# EAGLE schematic Motor-Board (EAGLE 7.3.0)

## Sheet 1 of 5
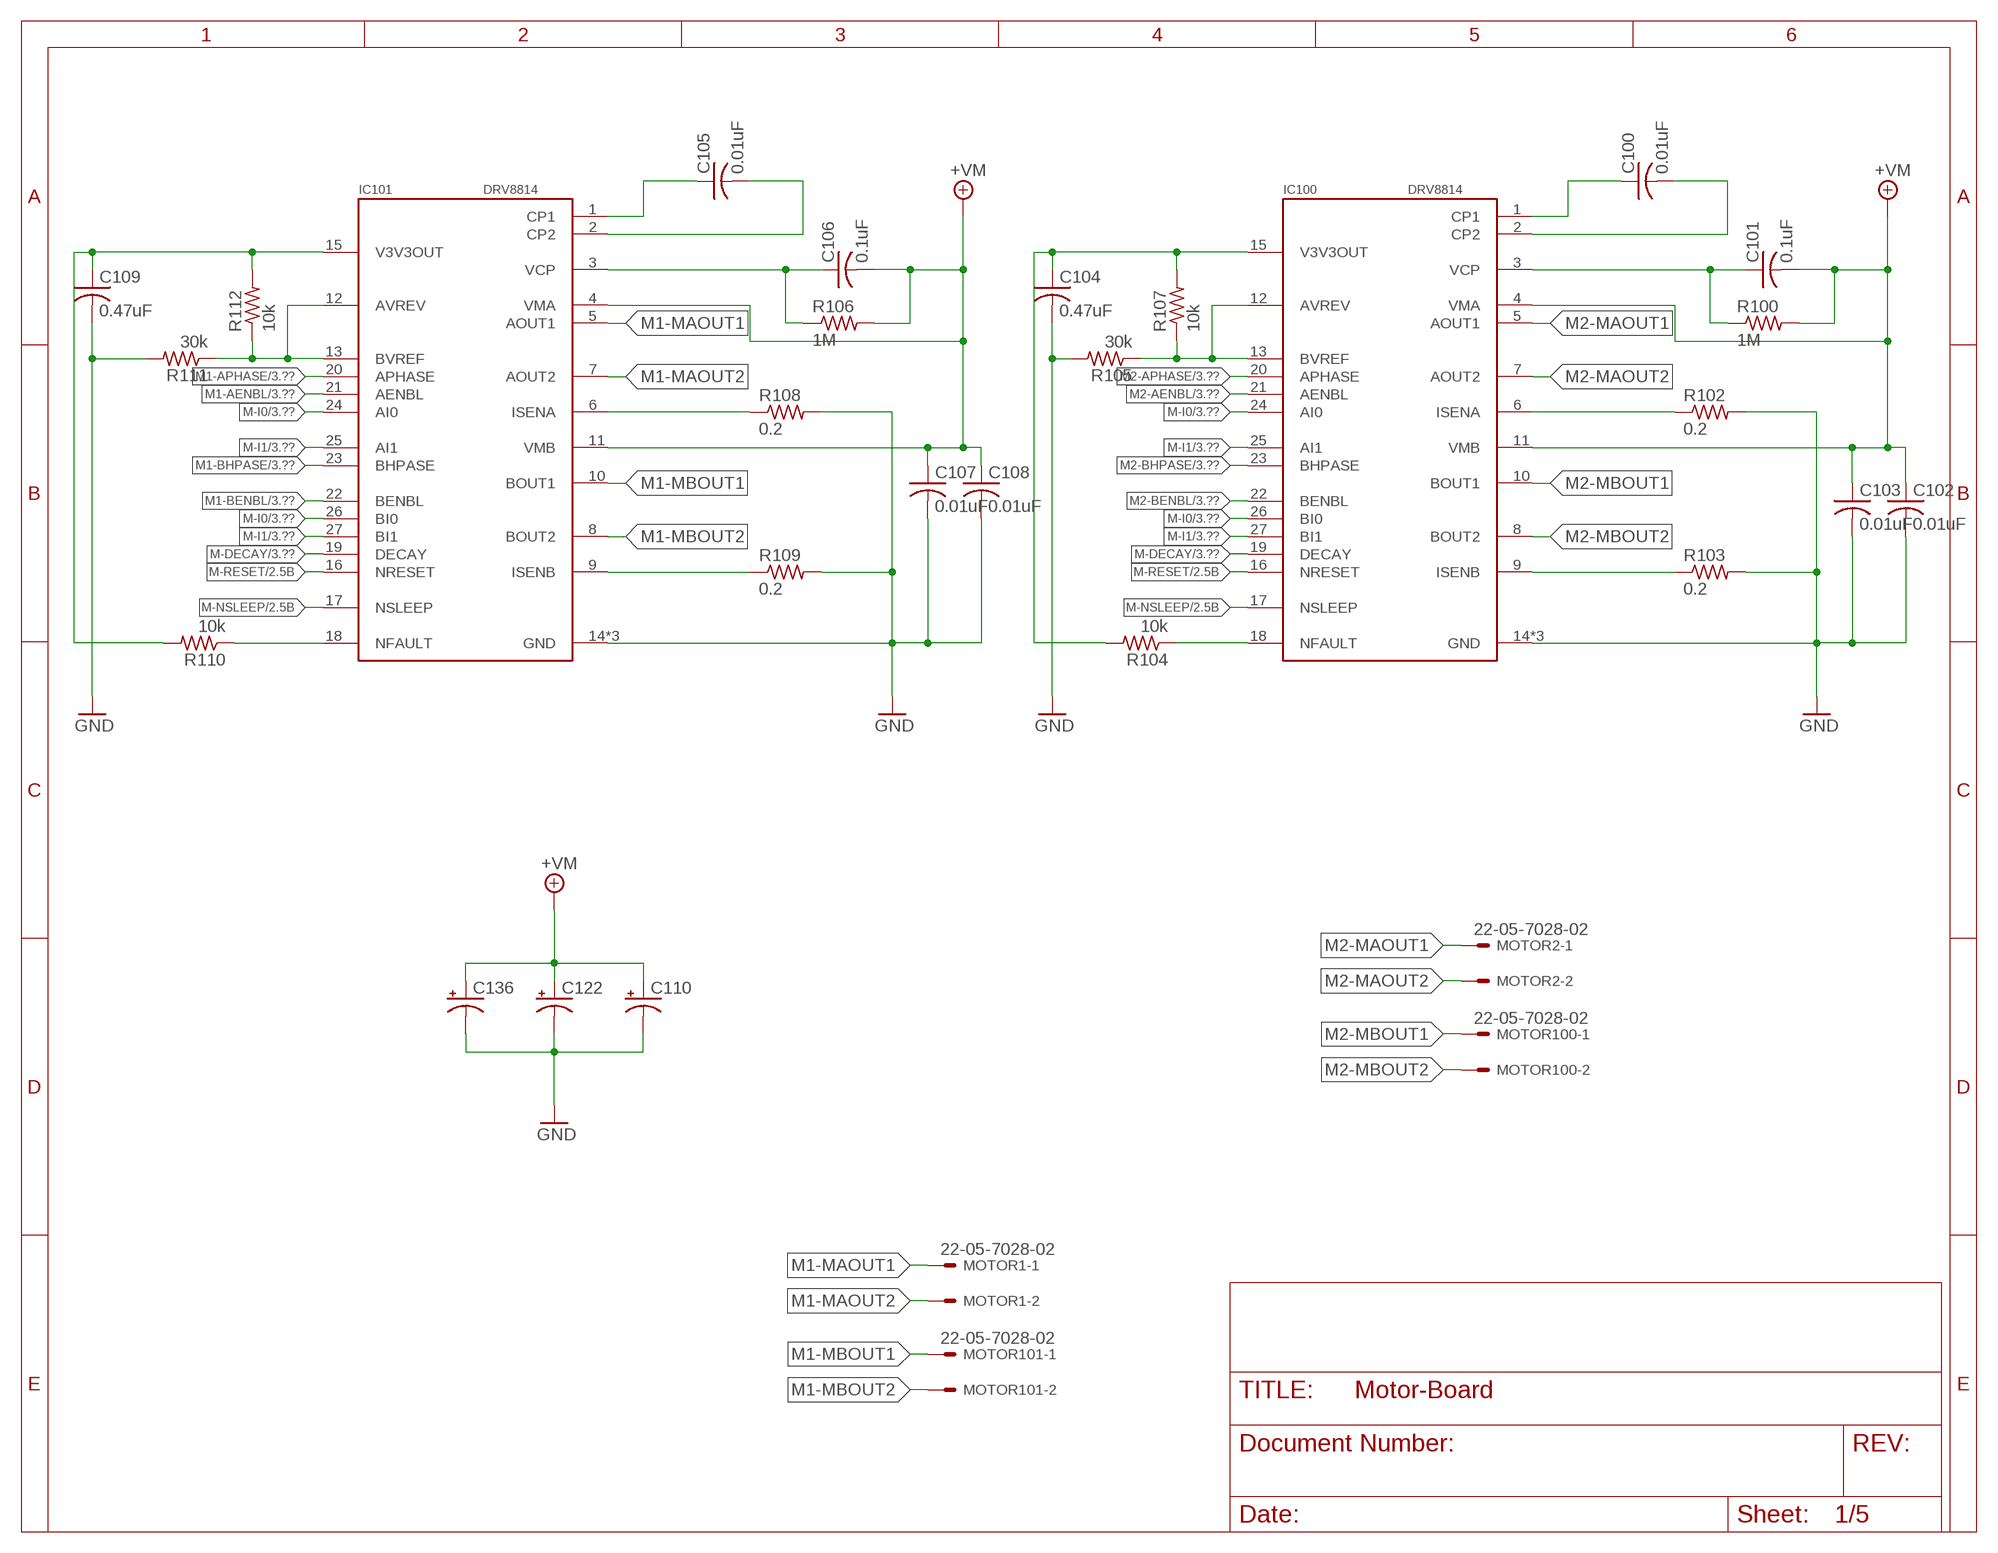
[diagram p0: schematic, sheet 1]

### Parts
C100  0.01uF  C-USC0402  [C0402]
C101  0.1uF  C-USC0402  [C0402]
C102  0.01uF  C-USC0402  [C0402]
C103  0.01uF  C-USC0402  [C0402]
C104  0.47uF  C-USC0402  [C0402]
C105  0.01uF  C-USC0402  [C0402]
C106  0.1uF  C-USC0402  [C0402]
C107  0.01uF  C-USC0402  [C0402]
C108  0.01uF  C-USC0402  [C0402]
C109  0.47uF  C-USC0402  [C0402]
C110  CPOL-US153CLV-0605  [153CLV-0605]
C122  CPOL-US153CLV-0605  [153CLV-0605]
C136  CPOL-US153CLV-0605  [153CLV-0605]
IC100  DRV8814  DRV8818PWPR  [TSSOP-28]
IC101  DRV8814  DRV8818PWPR  [TSSOP-28]
MOTOR1  22-05-7028-02  [7395-02]
MOTOR2  22-05-7028-02  [7395-02]
MOTOR100  22-05-7028-02  [7395-02]
MOTOR101  22-05-7028-02  [7395-02]
R100  1M  R-US_R0402  [R0402]
R102  0.2  R-US_R0402  [R0402]
R103  0.2  R-US_R0402  [R0402]
R104  10k  R-US_R0402  [R0402]
R105  30k  R-US_R0402  [R0402]
R106  1M  R-US_R0402  [R0402]
R107  10k  R-US_R0402  [R0402]
R108  0.2  R-US_R0402  [R0402]
R109  0.2  R-US_R0402  [R0402]
R110  10k  R-US_R0402  [R0402]
R111  30k  R-US_R0402  [R0402]
R112  10k  R-US_R0402  [R0402]

### Nets
+7V [VM]: C101.2 C102.1 C103.1 C106.2 C107.1 C108.1 C110.+ C122.+ C136.+ IC100.4(VMA) IC100.11(VMB) IC101.4(VMA) IC101.11(VMB) R100.2 R106.2 ; supply symbol labelled +VM ; also sheet 2,3,4
GND: C102.2 C103.2 C104.2 C107.2 C108.2 C109.2 C110.- C122.- C136.- IC100.14(GND) IC100.28(GND) IC100.EXP(GND) IC101.14(GND) IC101.28(GND) IC101.EXP(GND) R102.2 R103.2 R105.2 R108.2 R109.2 R111.2 ; also sheet 2,3,4
M1-AENBL: IC101.21(AENBL) ; also sheet 3
M1-APHASE: IC101.20(APHASE) ; also sheet 3
M1-BENBL: IC101.22(BENBL) ; also sheet 3
M1-BHPASE: IC101.23(BHPASE) ; also sheet 3
M1-MAOUT1: IC101.5(AOUT1) MOTOR1.1
M1-MAOUT2: IC101.7(AOUT2) MOTOR1.2
M1-MBOUT1: IC101.10(BOUT1) MOTOR101.1
M1-MBOUT2: IC101.8(BOUT2) MOTOR101.2
M2-AENBL: IC100.21(AENBL) ; also sheet 3
M2-APHASE: IC100.20(APHASE) ; also sheet 3
M2-BENBL: IC100.22(BENBL) ; also sheet 3
M2-BHPASE: IC100.23(BHPASE) ; also sheet 3
M2-MAOUT1: IC100.5(AOUT1) MOTOR2.1
M2-MAOUT2: IC100.7(AOUT2) MOTOR2.2
M2-MBOUT1: IC100.10(BOUT1) MOTOR100.1
M2-MBOUT2: IC100.8(BOUT2) MOTOR100.2
M-DECAY: IC100.19(DECAY) IC101.19(DECAY) ; also sheet 3
M-I0: IC100.24(AI0) IC100.26(BI0) IC101.24(AI0) IC101.26(BI0) ; also sheet 3
M-I1: IC100.25(AI1) IC100.27(BI1) IC101.25(AI1) IC101.27(BI1) ; also sheet 3
M-NSLEEP: IC100.17(NSLEEP) IC101.17(NSLEEP) ; also sheet 2,3
M-RESET: IC100.16(NRESET) IC101.16(NRESET) ; also sheet 2,3
N$1: C105.2 IC101.2(CP2)
N$2: C105.1 IC101.1(CP1)
N$3: C106.1 IC101.3(VCP) R106.1
N$4: IC101.6(ISENA) R108.1
N$5: C100.2 IC100.2(CP2)
N$6: C100.1 IC100.1(CP1)
N$7: C101.1 IC100.3(VCP) R100.1
N$8: IC100.6(ISENA) R102.1
N$9: IC100.9(ISENB) R103.1
N$10: IC101.9(ISENB) R109.1
N$11: IC100.12(AVREV) IC100.13(BVREF) R105.1 R107.1
N$12: IC101.12(AVREV) IC101.13(BVREF) R111.1 R112.1
N$29 [+3v3]: C109.1 IC101.15(V3V3OUT) R110.2 R112.2
N$31: IC101.18(NFAULT) R110.1
N$35: IC100.18(NFAULT) R104.1
N$37 [+3v3]: C104.1 IC100.15(V3V3OUT) R104.2 R107.2

## Sheet 2 of 5
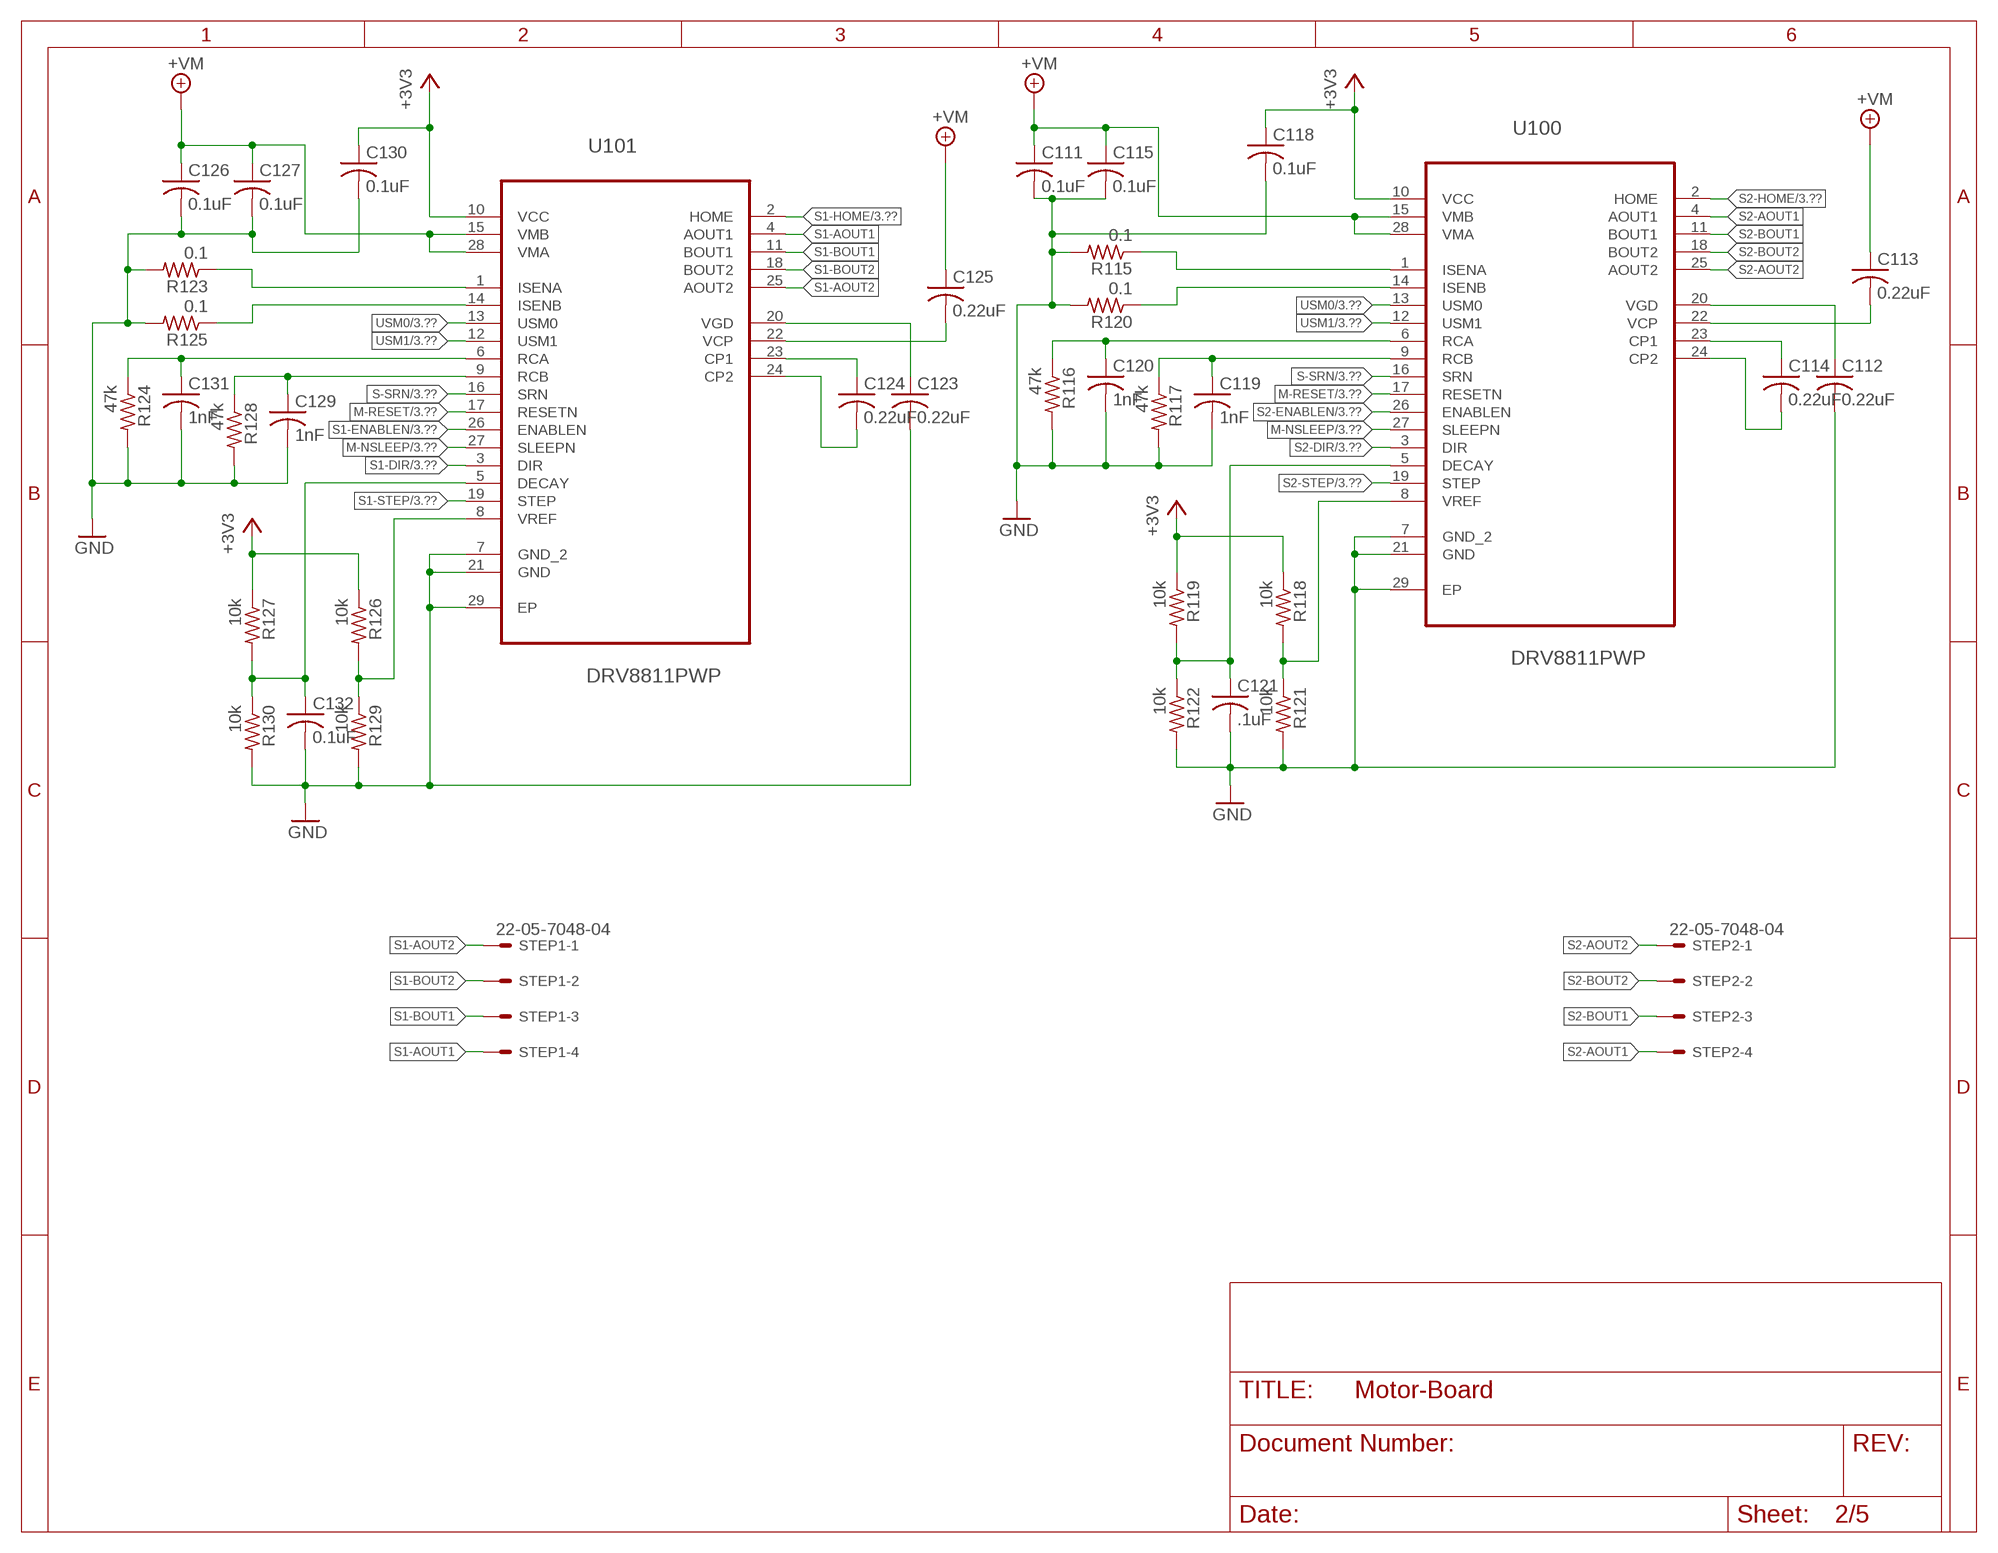
[diagram p1: schematic, sheet 2]

### Parts
C111  0.1uF  C-USC0402  [C0402]
C112  0.22uF  C-USC0402  [C0402]
C113  0.22uF  C-USC0402  [C0402]
C114  0.22uF  C-USC0402  [C0402]
C115  0.1uF  C-USC0402  [C0402]
C118  0.1uF  C-USC0402  [C0402]
C119  1nF  C-USC0402  [C0402]
C120  1nF  C-USC0402  [C0402]
C121  .1uF  C-USC0402  [C0402]
C123  0.22uF  C-USC0402  [C0402]
C124  0.22uF  C-USC0402  [C0402]
C125  0.22uF  C-USC0402  [C0402]
C126  0.1uF  C-USC0402  [C0402]
C127  0.1uF  C-USC0402  [C0402]
C129  1nF  C-USC0402  [C0402]
C130  0.1uF  C-USC0402  [C0402]
C131  1nF  C-USC0402  [C0402]
C132  0.1uF  C-USC0402  [C0402]
R115  0.1  R-US_R0402  [R0402]
R116  47k  R-US_R0402  [R0402]
R117  47k  R-US_R0402  [R0402]
R118  10k  R-US_R0402  [R0402]
R119  10k  R-US_R0402  [R0402]
R120  0.1  R-US_R0402  [R0402]
R121  10k  R-US_R0402  [R0402]
R122  10k  R-US_R0402  [R0402]
R123  0.1  R-US_R0402  [R0402]
R124  47k  R-US_R0402  [R0402]
R125  0.1  R-US_R0402  [R0402]
R126  10k  R-US_R0402  [R0402]
R127  10k  R-US_R0402  [R0402]
R128  47k  R-US_R0402  [R0402]
R129  10k  R-US_R0402  [R0402]
R130  10k  R-US_R0402  [R0402]
STEP1  22-05-7048-04  [7395-04]
STEP2  22-05-7048-04  [7395-04]
U100  DRV8811PWP  [SOP65P640X120-29N]
U101  DRV8811PWP  [SOP65P640X120-29N]

### Nets
+3V3 [+3v3]: C118.1 C130.1 R118.1 R119.1 R126.1 R127.1 U100.10(VCC) U101.10(VCC) ; also sheet 3
+7V [VM]: C111.1 C113.1 C115.1 C125.1 C126.1 C127.1 U100.15(VMB) U100.28(VMA) U101.15(VMB) U101.28(VMA) ; supply symbol labelled +VM ; also sheet 1,3,4
GND: C111.2 C112.2 C115.2 C118.2 C119.2 C120.2 C121.2 C123.2 C126.2 C127.2 C129.2 C130.2 C131.2 C132.2 R115.2 R116.2 R117.2 R120.2 R121.2 R122.2 R123.2 R124.2 R125.2 R128.2 R129.2 R130.2 U100.7(GND_2) U100.21(GND) U100.29(EP) U101.7(GND_2) U101.21(GND) U101.29(EP) ; also sheet 1,3,4
M-NSLEEP: U100.27(SLEEPN) U101.27(SLEEPN) ; also sheet 1,3
M-RESET: U100.17(RESETN) U101.17(RESETN) ; also sheet 1,3
N$13: R125.1 U101.14(ISENB)
N$14: R123.1 U101.1(ISENA)
N$15: R120.1 U100.14(ISENB)
N$16: R115.1 U100.1(ISENA)
N$17: C120.1 R116.1 U100.6(RCA)
N$18: C131.1 R124.1 U101.6(RCA)
N$19: C129.1 R128.1 U101.9(RCB)
N$20: C119.1 R117.1 U100.9(RCB)
N$21: C121.1 R119.2 R122.1 U100.5(DECAY)
N$22: R118.2 R121.1 U100.8(VREF)
N$23: C114.1 U100.23(CP1)
N$24: C114.2 U100.24(CP2)
N$26: C132.1 R127.2 R130.1 U101.5(DECAY)
N$27: C112.1 U100.20(VGD)
N$28: C113.2 U100.22(VCP)
N$30: R126.2 R129.1 U101.8(VREF)
N$32: C124.1 U101.23(CP1)
N$33: C124.2 U101.24(CP2)
N$34: C123.1 U101.20(VGD)
N$36: C125.2 U101.22(VCP)
S1-AOUT1: STEP1.4 U101.4(AOUT1)
S1-AOUT2: STEP1.1 U101.25(AOUT2)
S1-BOUT1: STEP1.3 U101.11(BOUT1)
S1-BOUT2: STEP1.2 U101.18(BOUT2)
S1-DIR: U101.3(DIR) ; also sheet 3
S1-ENABLEN: U101.26(ENABLEN) ; also sheet 3
S1-HOME: U101.2(HOME) ; also sheet 3
S1-STEP: U101.19(STEP) ; also sheet 3
S2-AOUT1: STEP2.4 U100.4(AOUT1)
S2-AOUT2: STEP2.1 U100.25(AOUT2)
S2-BOUT1: STEP2.3 U100.11(BOUT1)
S2-BOUT2: STEP2.2 U100.18(BOUT2)
S2-DIR: U100.3(DIR) ; also sheet 3
S2-ENABLEN: U100.26(ENABLEN) ; also sheet 3
S2-HOME: U100.2(HOME) ; also sheet 3
S2-STEP: U100.19(STEP) ; also sheet 3
S-SRN: U100.16(SRN) U101.16(SRN) ; also sheet 3
USM0: U100.13(USM0) U101.13(USM0) ; also sheet 3
USM1: U100.12(USM1) U101.12(USM1) ; also sheet 3

## Sheet 3 of 5
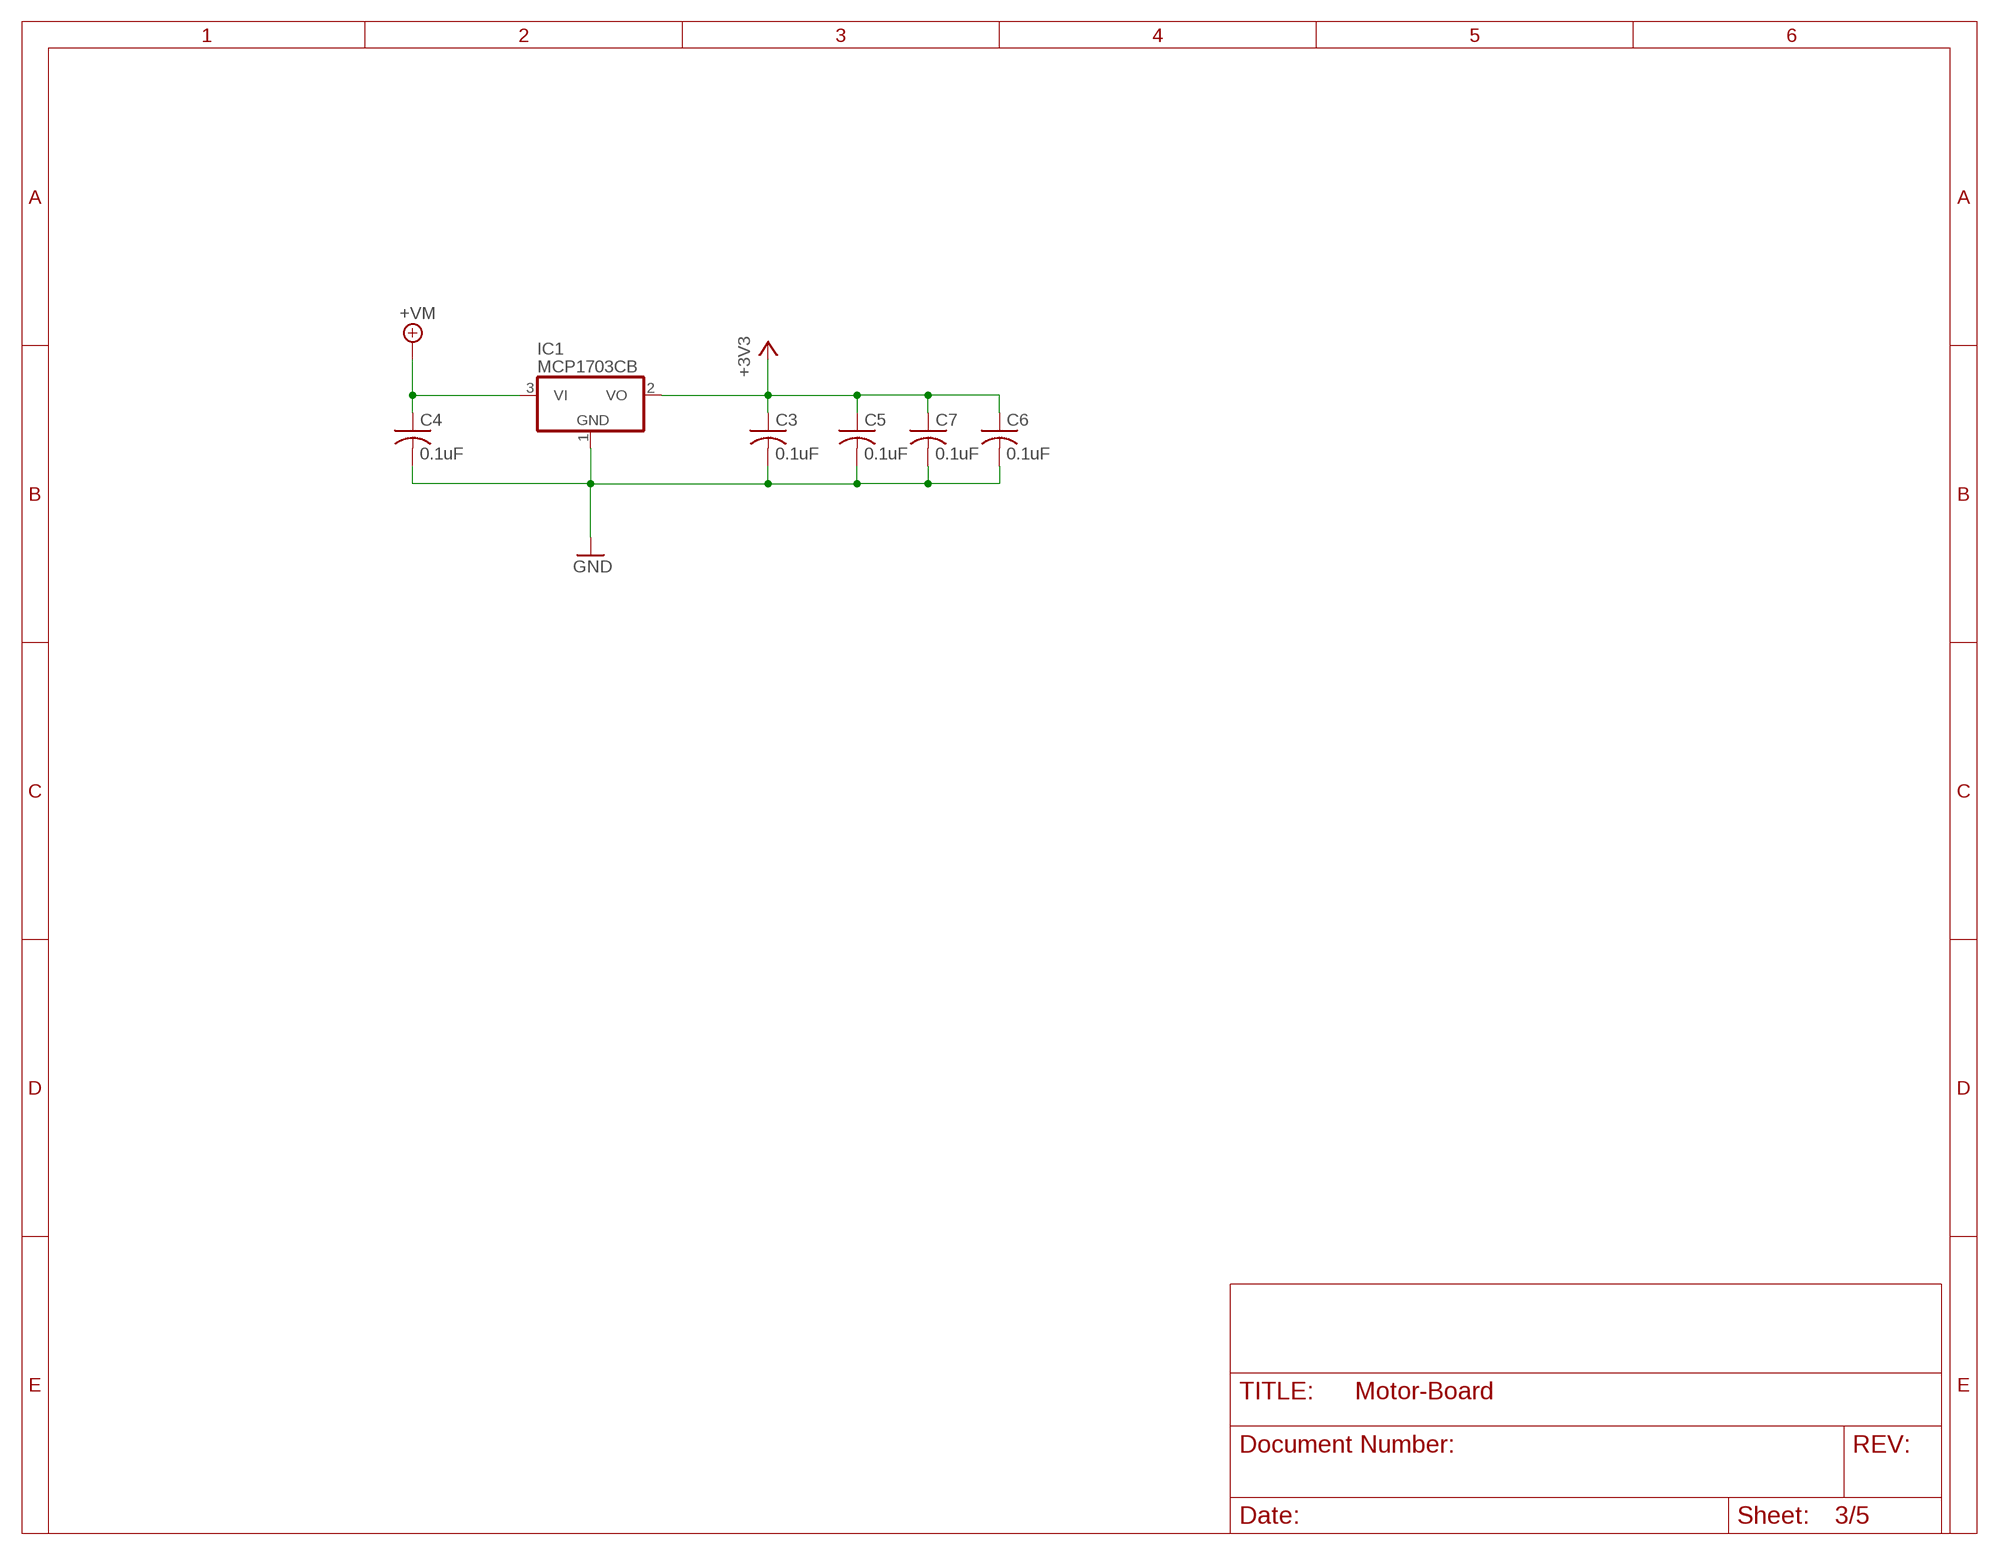
[diagram p2: schematic, sheet 3, part 1 of 2]
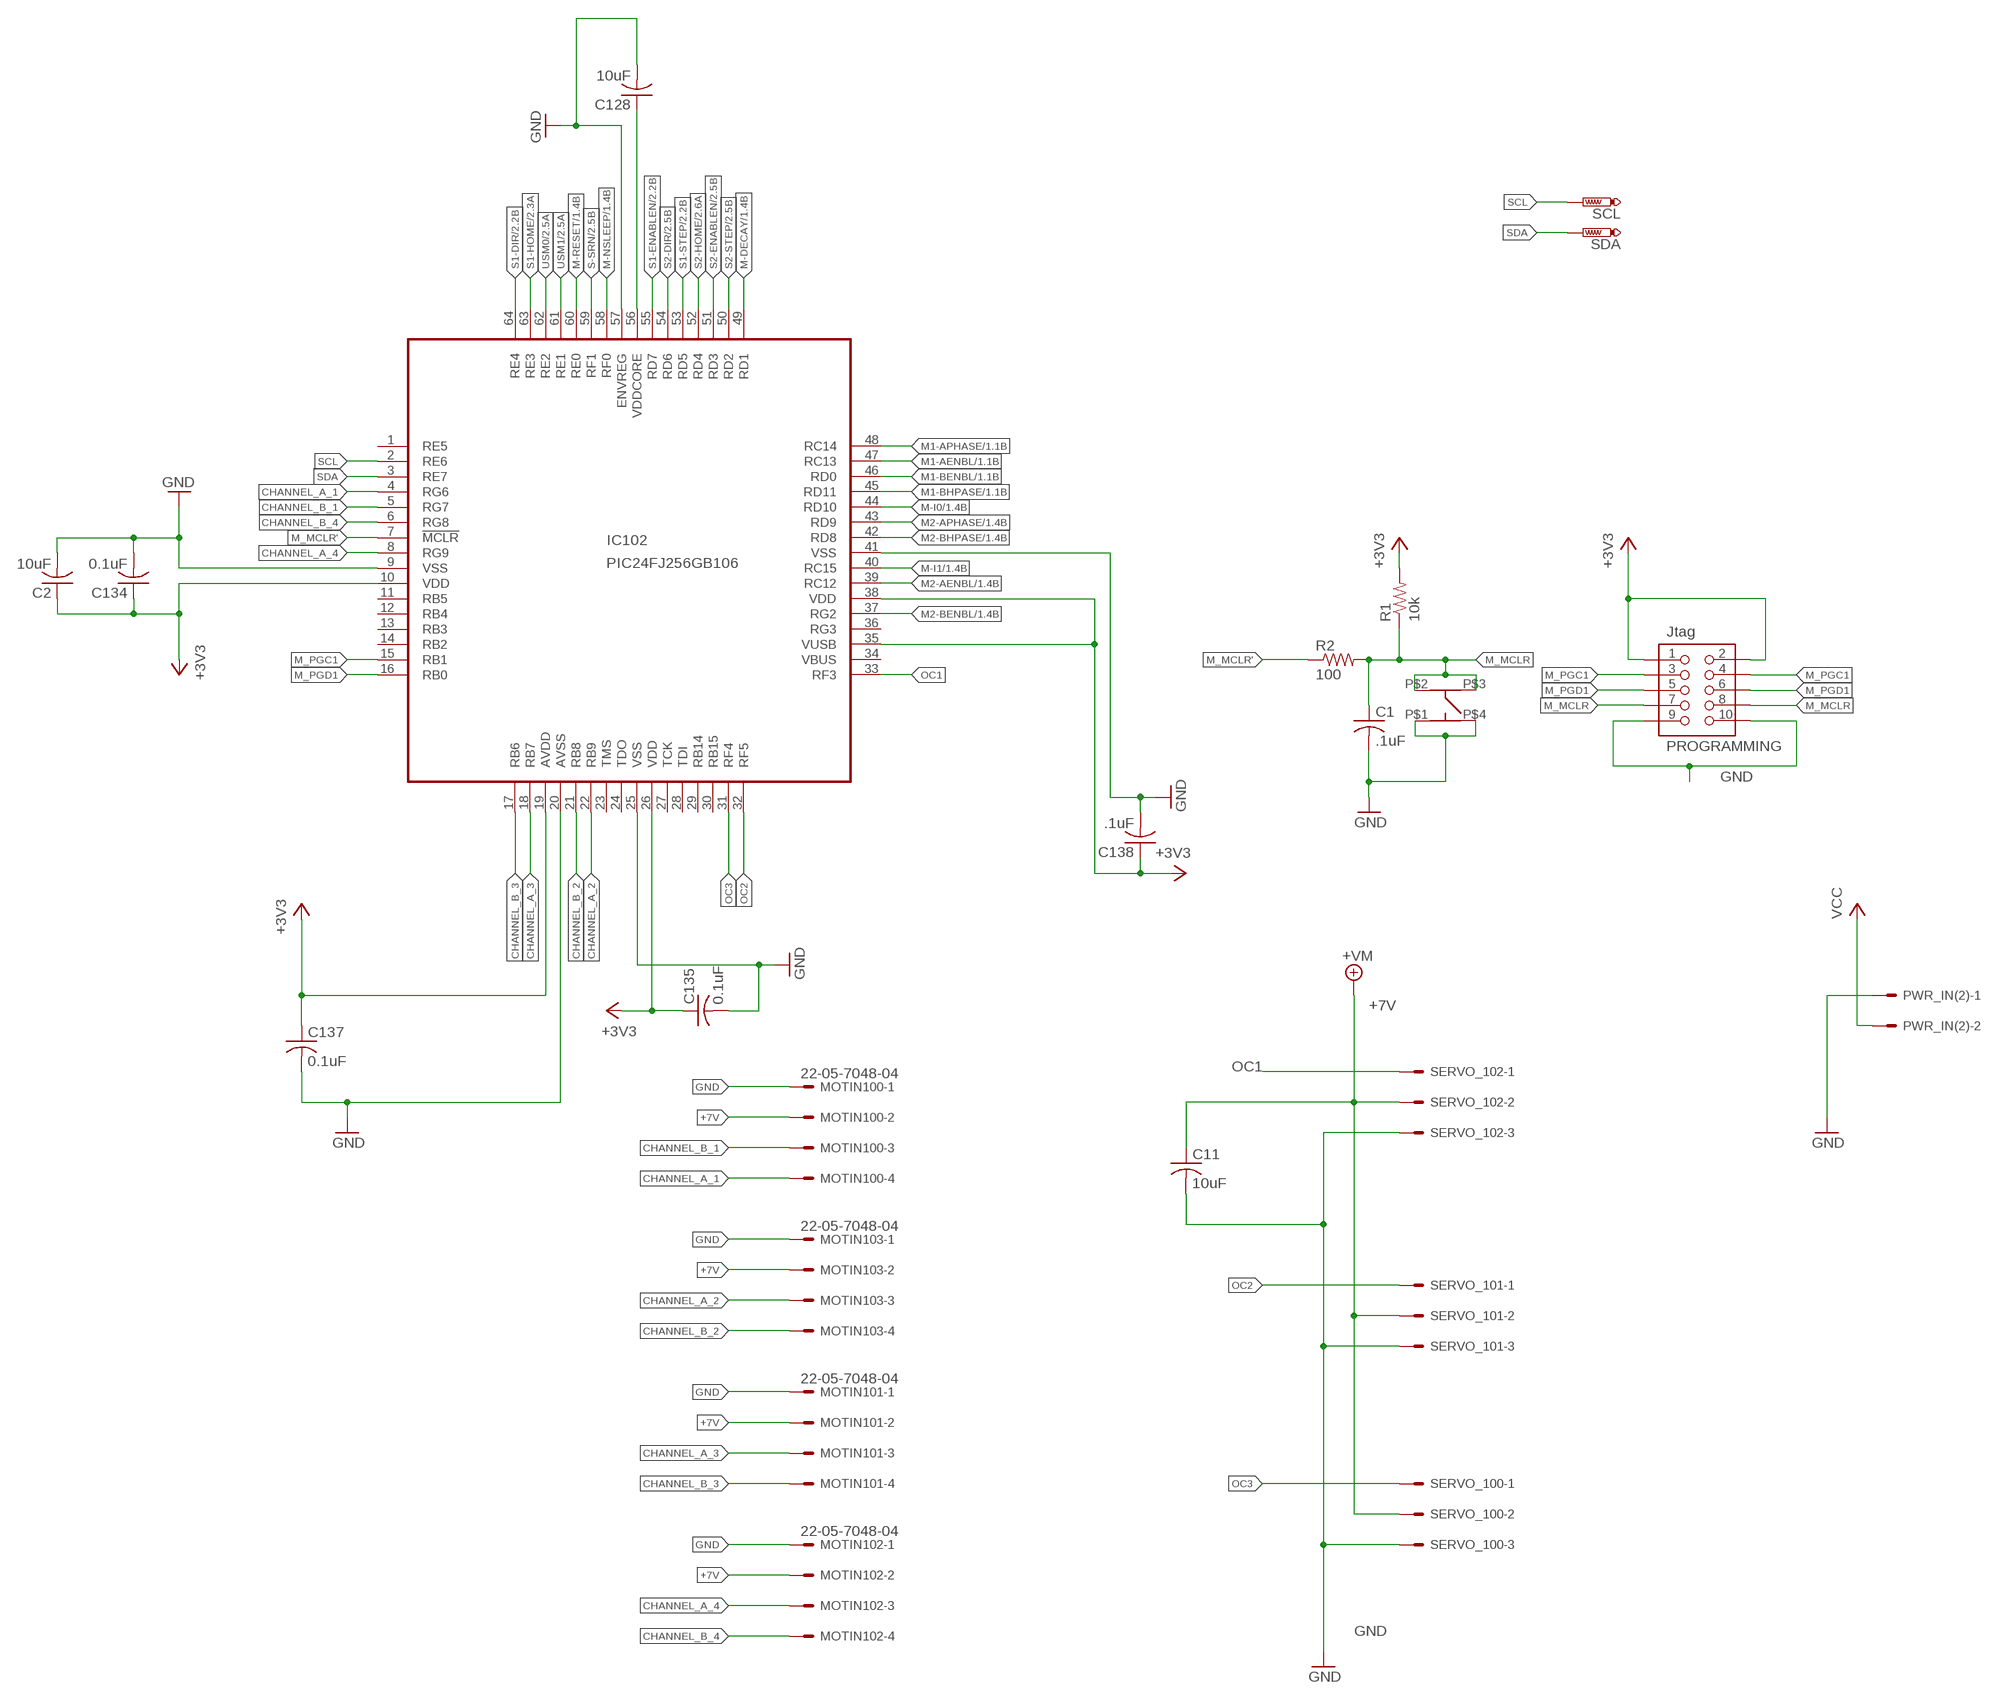
[diagram p3: schematic, sheet 3, part 2 of 2]

### Parts
C1  .1uF  C-USC0402  [C0402]
C2  10uF  C-USC0402  [C0402]
C3  0.1uF  C-USC0402  [C0402]
C4  0.1uF  C-USC0402  [C0402]
C5  0.1uF  C-USC0402  [C0402]
C6  0.1uF  C-USC0402  [C0402]
C7  0.1uF  C-USC0402  [C0402]
C11  10uF  C-USC0805  [C0805]
C128  10uF  C-USC0402  [C0402]
C134  0.1uF  C-USC0402  [C0402]
C135  0.1uF  C-USC0402  [C0402]
C137  0.1uF  C-USC0402  [C0402]
C138  .1uF  C-USC0402  [C0402]
IC1  MCP1703CB  [SOT23]
IC102  PIC24FJ256GB106  [TQFP64-10X10]
MOTIN100  22-05-7048-04  [7395-04]
MOTIN101  22-05-7048-04  [7395-04]
MOTIN102  22-05-7048-04  [7395-04]
MOTIN103  22-05-7048-04  [7395-04]
PROGRAMMING  Jtag  MOTHER-BOARD-REV5_PIN-CONNECTOR74089  [MOTHER-BOARD-REV5_10-PIN-SMD]
PWR_IN(2)  555X-2H  [5569-2]
R1  10k  R-US_R0402  [R0402]
R2  100  R-US_R0402  [R0402]
SCL  PTR1B1,27  [B1,27]
SDA  PTR1B1,27  [B1,27]
SERVO_100  22-05-7038-03  [7395-03]
SERVO_101  22-05-7038-03  [7395-03]
SERVO_102  22-05-7038-03  [7395-03]
U$100  Switch3  MC32882_SW  [MC32882_FINAL]

### Nets
+3V3 [+3v3]: C2.1 C3.1 C5.1 C6.1 C7.1 C134.1 C135.1 C137.1 C138.1 IC1.2(VO) IC102.10(VDD) IC102.19(AVDD) IC102.26(VDD) IC102.35(VUSB) IC102.38(VDD) PROGRAMMING.1 PROGRAMMING.2 R1.2 ; also sheet 2
+7V [VM]: C4.1 C11.1 IC1.3(VI) MOTIN100.2 MOTIN101.2 MOTIN102.2 MOTIN103.2 SERVO_100.2 SERVO_101.2 SERVO_102.2 ; supply symbol labelled +VM ; also sheet 1,2,4
CHANNEL_A_1: IC102.4(RG6) MOTIN100.4
CHANNEL_A_2: IC102.22(RB9) MOTIN103.3
CHANNEL_A_3: IC102.18(RB7) MOTIN101.3
CHANNEL_A_4: IC102.8(RG9) MOTIN102.3
CHANNEL_B_1: IC102.5(RG7) MOTIN100.3
CHANNEL_B_2: IC102.21(RB8) MOTIN103.4
CHANNEL_B_3: IC102.17(RB6) MOTIN101.4
CHANNEL_B_4: IC102.6(RG8) MOTIN102.4
GND: C1.2 C2.2 C3.2 C4.2 C5.2 C6.2 C7.2 C11.2 C128.2 C134.2 C135.2 C137.2 C138.2 IC1.1(GND) IC102.9(VSS) IC102.20(AVSS) IC102.25(VSS) IC102.41(VSS) IC102.57(ENVREG) MOTIN100.1 MOTIN101.1 MOTIN102.1 MOTIN103.1 PROGRAMMING.9 PROGRAMMING.10 PWR_IN(2).1 SERVO_100.3 SERVO_101.3 SERVO_102.3 U$100.P$1(P1) U$100.P$4(P4) ; also sheet 1,2,4
M1-AENBL: IC102.47(RC13) ; also sheet 1
M1-APHASE: IC102.48(RC14) ; also sheet 1
M1-BENBL: IC102.46(RD0) ; also sheet 1
M1-BHPASE: IC102.45(RD11) ; also sheet 1
M2-AENBL: IC102.39(RC12) ; also sheet 1
M2-APHASE: IC102.43(RD9) ; also sheet 1
M2-BENBL: IC102.37(RG2) ; also sheet 1
M2-BHPASE: IC102.42(RD8) ; also sheet 1
M-DECAY: IC102.49(RD1) ; also sheet 1
M-I0: IC102.44(RD10) ; also sheet 1
M-I1: IC102.40(RC15) ; also sheet 1
M-NSLEEP: IC102.58(RF0) ; also sheet 1,2
M-RESET: IC102.60(RE0) ; also sheet 1,2
M_MCLR: C1.1 PROGRAMMING.7 PROGRAMMING.8 R1.1 R2.2 U$100.P$2(P2) U$100.P$3(P3)
M_MCLR': IC102.7(!MCLR) R2.1
M_PGC1: IC102.15(RB1) PROGRAMMING.3 PROGRAMMING.4
M_PGD1: IC102.16(RB0) PROGRAMMING.5 PROGRAMMING.6
N$39: C128.1 IC102.56(VDDCORE)
OC1: IC102.33(RF3) SERVO_102.1
OC2: IC102.32(RF5) SERVO_101.1
OC3: IC102.31(RF4) SERVO_100.1
S1-DIR: IC102.64(RE4) ; also sheet 2
S1-ENABLEN: IC102.55(RD7) ; also sheet 2
S1-HOME: IC102.63(RE3) ; also sheet 2
S1-STEP: IC102.53(RD5) ; also sheet 2
S2-DIR: IC102.54(RD6) ; also sheet 2
S2-ENABLEN: IC102.51(RD3) ; also sheet 2
S2-HOME: IC102.52(RD4) ; also sheet 2
S2-STEP: IC102.50(RD2) ; also sheet 2
S-SRN: IC102.59(RF1) ; also sheet 2
SCL: IC102.2(RE6) SCL.TP
SDA: IC102.3(RE7) SDA.TP
USM0: IC102.62(RE2) ; also sheet 2
USM1: IC102.61(RE1) ; also sheet 2
VCC: PWR_IN(2).2 ; also sheet 4
Unconnected: IC102.1(RE5) IC102.11(RB5) IC102.12(RB4) IC102.13(RB3) IC102.14(RB2) IC102.23(TMS) IC102.24(TDO) IC102.27(TCK) IC102.28(TDI) IC102.29(RB14) IC102.30(RB15) IC102.34(VBUS) IC102.36(RG3)

## Sheet 4 of 5
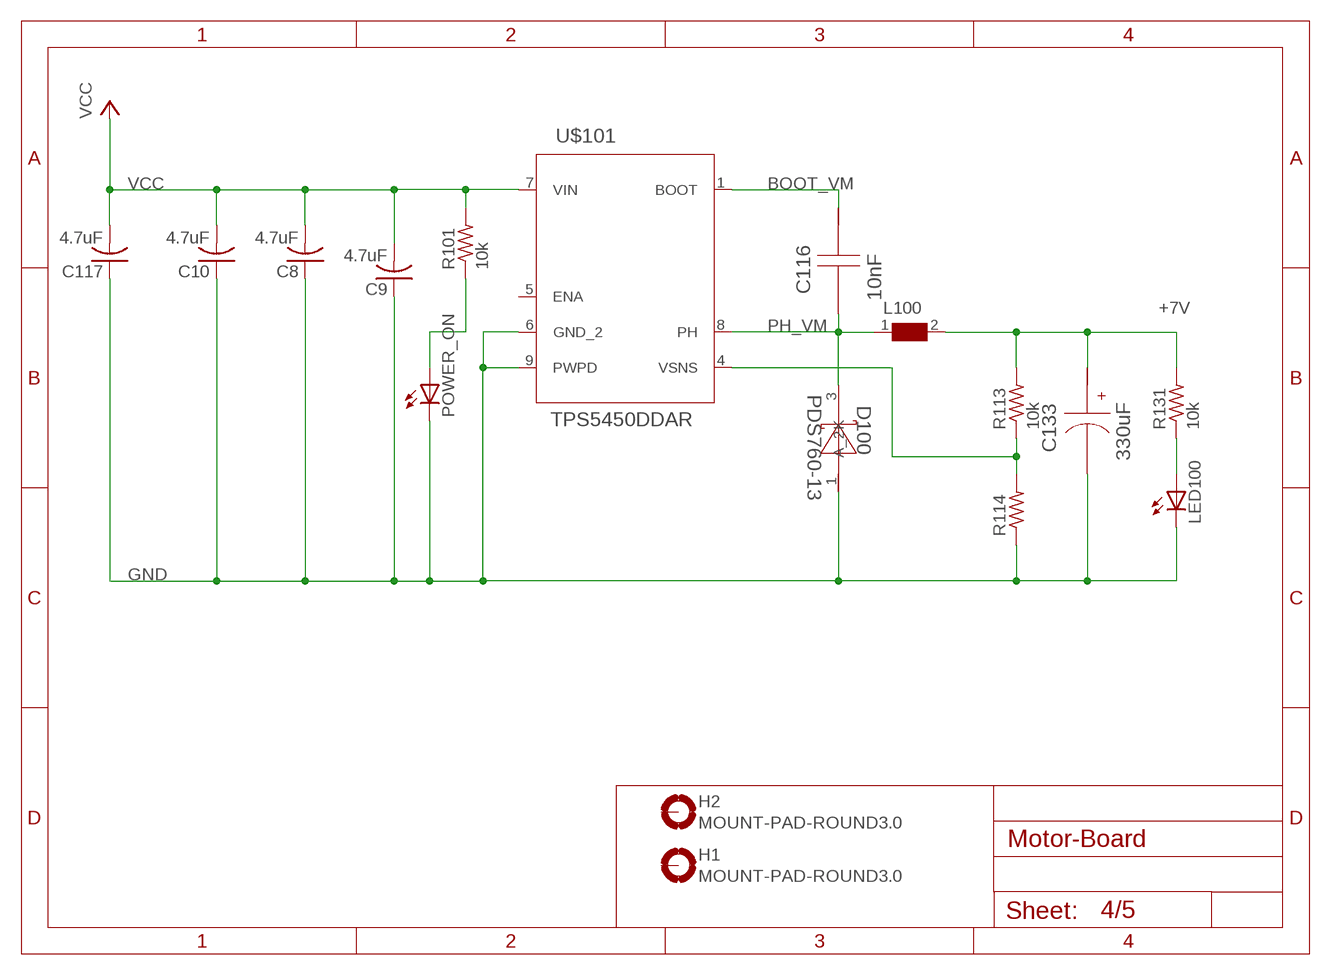
[diagram p4: schematic, sheet 4]

### Parts
C8  4.7uF  C-USC0805  [C0805]
C9  4.7uF  C-USC0805  [C0805]
C10  4.7uF  C-USC0805  [C0805]
C116  10nF  C0805C103K5RACTU  [0805]
C117  4.7uF  C-USC0805  [C0805]
C133  330uF  10SVP330MX  [SM_RADIAL_10AMM]
D100  PDS760-13  [POWERDI5]
H1  MOUNT-PAD-ROUND3.0  [3,0-PAD]
H2  MOUNT-PAD-ROUND3.0  [3,0-PAD]
L100  WE-HCC-7443331000_1090  [WE-HCC_1090]
LED100  LEDCHIP-LED0603  [CHIP-LED0603]
POWER_ON  LEDCHIP-LED0603  [CHIP-LED0603]
R101  10k  R-US_R0402  [R0402]
R113  10k  R-US_R0402  [R0402]
R114  R-US_R0402  [R0402]
R131  10k  R-US_R0402  [R0402]
U$101  TPS5450DDAR  [R-PDSO-G8]

### Nets
+7V [VM]: C133.1(+) L100.2 R113.2 R131.2 ; also sheet 1,2,3
BOOT_VM: C116.1 U$101.1(BOOT)
GND: C8.1 C9.1 C10.1 C117.1 C133.2(-) D100.1(A_2) LED100.C POWER_ON.C R114.1 U$101.6(GND_2) U$101.9(PWPD) ; also sheet 1,2,3
N$25: LED100.A R131.1
N$38: POWER_ON.A R101.1
PH_VM: C116.2 D100.3(K) L100.1 U$101.8(PH)
VCC: C8.2 C9.2 C10.2 C117.2 R101.2 U$101.7(VIN) ; also sheet 3
VSNS_VM: R113.1 R114.2 U$101.4(VSNS)
Unconnected: H1.B3,0(MOUNT) H2.B3,0(MOUNT) U$101.5(ENA)

## Sheet 5 of 5

## Library data of the parts
C1-C11 C100-C109 C111-C115 C117-C121 C123-C132 C134 C135 C137 C138 = rcl:C-US: CAPACITOR, American symbol
C110 C122 C136 = rcl:CPOL-US: POLARIZED CAPACITOR, American symbol
C116 = 5v:C0805C103K5RACTU; CAP: 1.0E-8; ESR: 1.739; IRMS: 0.411; MANUFACTURER_NAME: Kemet; MANUFACTURER_PART_NUMBER: C0805C103K5RACTU; VDC: 50.0; VENDOR: Kemet
C133 = 5v:10SVP330MX; CAP: 3.3E-4; DATASHEETURL: http://www.edc.sanyo.com/english/pdf/oscon/E32.pdf; ESR: 0.025; IRMS: 3.7; MANUFACTURER_NAME: Panasonic; MANUFACTURER_PART_NUMBER: 10SVP330MX; VDC: 10.0; VENDOR: Panasonic
D100 = 5v:PDS760-13; DATASHEETURL: www.diodes.com/datasheets/ds30477.pdf; IO: 7.0; MANUFACTURER_NAME: Diodes Inc.; MANUFACTURER_PART_NUMBER: PDS760-13; VENDOR: Diodes Inc.; VFATIO: 0.56; VRRM: 60.0
H1 H2 = holes:MOUNT-PAD-ROUND: MOUNTING PAD, round
IC1 = linear:MCP1703: 250 mA, 16V, Low Quiescent Current LDO Regulator Source: http://ww1.microchip.com/downloads/en/DeviceDoc/22049b.pdf
IC100 IC101 = Motor-Board:DRV8818PWPR: Driver controlador de motor en paquete HTSSOP
IC102 = microchip:PIC24FJ256GB106: PIC24FJ256GB106 edit this description Auto generated by make-symbol-device-package-bsdl.ulp Rev. 25 Source: PIC24FJ256GB106.bsd; MPN: PIC24FJ256GB106-I/PT; OC_FARNELL: 1576868; OC_NEWARK: 54M5129
L100 = WE-HCC:WE-HCC: SMD High Current Cube Inductor WE-HCC - magnetically shieled - current capability up to 27A - excellent saturation characteristics -- filter choke for DC/DC converter -- single and polyphase buck converter -- filter choke for motor electronics; MPN: 7443331000; OC_FARNELL: 1848254; OC_NEWARK: 13T9771; PACKAGE: 1090; SUPPLIER: Wuerth Elektronik
LED100 POWER_ON = led:LED: LED OSRAM: - CHIPLED LG R971, LG N971, LY N971, LG Q971, LY Q971, LO R971, LY R971 LH N974, LH R974 LS Q976, LO Q976, LY Q976 LO Q996 - Hyper CHIPLED LW Q18S LB Q993, LB Q99A, LB R99A - SideLED LS A670, LO A670, LY A670, LG A670, LP A670 LB A673, LV A673, LT A673, LW A673 LH A674 LY A675 LS A676, LA A676, LO A676, LY A676, LW A676 LS A679, LY A679, LG A679 - Hyper Micro SIDELED® LS Y876, LA Y876, LO Y876, LY Y876 LT Y87S - SmartLED LW L88C, LW L88S LB L89C, LB L89S, LG L890 LS L89K, LO L89K, LY L89K LS L896, LA L896, LO L896, LY L896 - TOPLED LS T670, LO T670, LY T670, LG T670, LP T670 LSG T670, LSP T670, LSY T670, LOP T670, LYG T670 LG T671, LOG T671, LSG T671 LB T673, LV T673, LT T673, LW T673 LH T674 LS T676, LA T676, LO T676, LY T676, LB T676, LH T676, LSB T676, LW T676 LB T67C, LV T67C, LT T67C, LS T67K, LO T67K, LY T67K, LW E67C LS E67B, LA E67B, LO E67B, LY E67B, LB E67C, LV E67C, LT E67C LW T67C LS T679, LY T679, LG T679 LS T770, LO T770, LY T770, LG T770, LP T770 LB T773, LV T773, LT T773, LW T773 LH T774 LS E675, LA E675, LY E675, LS T675 LS T776, LA T776, LO T776, LY T776, LB T776 LHGB T686 LT T68C, LB T68C - Hyper Mini TOPLED® LB M676 - Mini TOPLED Santana® LG M470 LS M47K, LO M47K, LY M47K Source: http://www.osram.convergy.de LUXEON: - LUMILED® LXK2-PW12-R00, LXK2-PW12-S00, LXK2-PW14-U00, LXK2-PW14-V00 LXK2-PM12-R00, LXK2-PM12-S00, LXK2-PM14-U00 LXK2-PE12-Q00, LXK2-PE12-R00, LXK2-PE12-S00, LXK2-PE14-T00, LXK2-PE14-U00 LXK2-PB12-K00, LXK2-PB12-L00, LXK2-PB12-M00, LXK2-PB14-N00, LXK2-PB14-P00, LXK2-PB14-Q00 LXK2-PR12-L00, LXK2-PR12-M00, LXK2-PR14-Q00, LXK2-PR14-R00 LXK2-PD12-Q00, LXK2-PD12-R00, LXK2-PD12-S00 LXK2-PH12-R00, LXK2-PH12-S00 LXK2-PL12-P00, LXK2-PL12-Q00, LXK2-PL12-R00 Source: www.luxeon.com KINGBRIGHT: KA-3528ASYC Source: www.kingbright.com
MOTIN100-MOTIN103 STEP1 STEP2 = Son_of_Dark_Power:22-?-04: CONNECTOR wire to board 2.54 mm (.1 inch) pitch header; OC_FARNELL: unknown; OC_NEWARK: unknown
MOTOR1 MOTOR2 MOTOR100 MOTOR101 = Son_of_Dark_Power:22-?-02: CONNECTOR wire to board 2.54 mm (.1 inch) pitch header; OC_FARNELL: 9731601; OC_NEWARK: unknown
PROGRAMMING = Mother-Board-rev5:MOTHER-BOARD-REV5_PIN-CONNECTOR
PWR_IN(2) = Son_of_Dark_Powersch:555X-2: Mini FIT connector 2 way
R1 R2 R100-R131 = rcl:R-US_: RESISTOR, American symbol
SCL SDA = testpad:PTR1: TEST PIN
SERVO_100-SERVO_102 = con-molex:22-?-03: CONNECTOR wire to board 2.54 mm (.1 inch) pitch header; OC_FARNELL: unknown; OC_NEWARK: unknown
U100 U101 = Texas Instruments_By_element14_Batch_1:DRV8811PWP: STEPPER MOTOR CONTROLLER IC; MPN: DRV8811PWP; OC_FARNELL: 1754829; OC_NEWARK: 24R9116; PACKAGE: HTSSOP-28; SUPPLIER: Texas Instruments
U$100 = Parts4Class:MC32882_SW
U$101 = 5v:TPS5450DDAR; DATASHEETURL: http://www.ti.com/product/tps5450; FREQUENCY: 500000.0; IMAX: 5.0; MANUFACTURER_NAME: Texas Instruments; MANUFACTURER_PART_NUMBER: TPS5450DDA; MKTG_PACKAGE: TPS5450; NSID: TPS5450DDAR; PACKAGE: TPS5450; VENDOR: Texas Instruments

## Net classes
0 default: width 0.203 mm, drill 0.33 mm, clearance 0.254 mm
1 +3v3: width 0.406 mm, drill 0.457 mm, clearance 0.254 mm
2 VM: width 0.508 mm, drill 0.533 mm, clearance 0.254 mm